# EAGLE schematic atmega32u4-au (EAGLE 8.1.0)
CNAME: ATMEGA32U4-AU; CREVISION: Rev. 0; DESIGNER: German Gonzalez
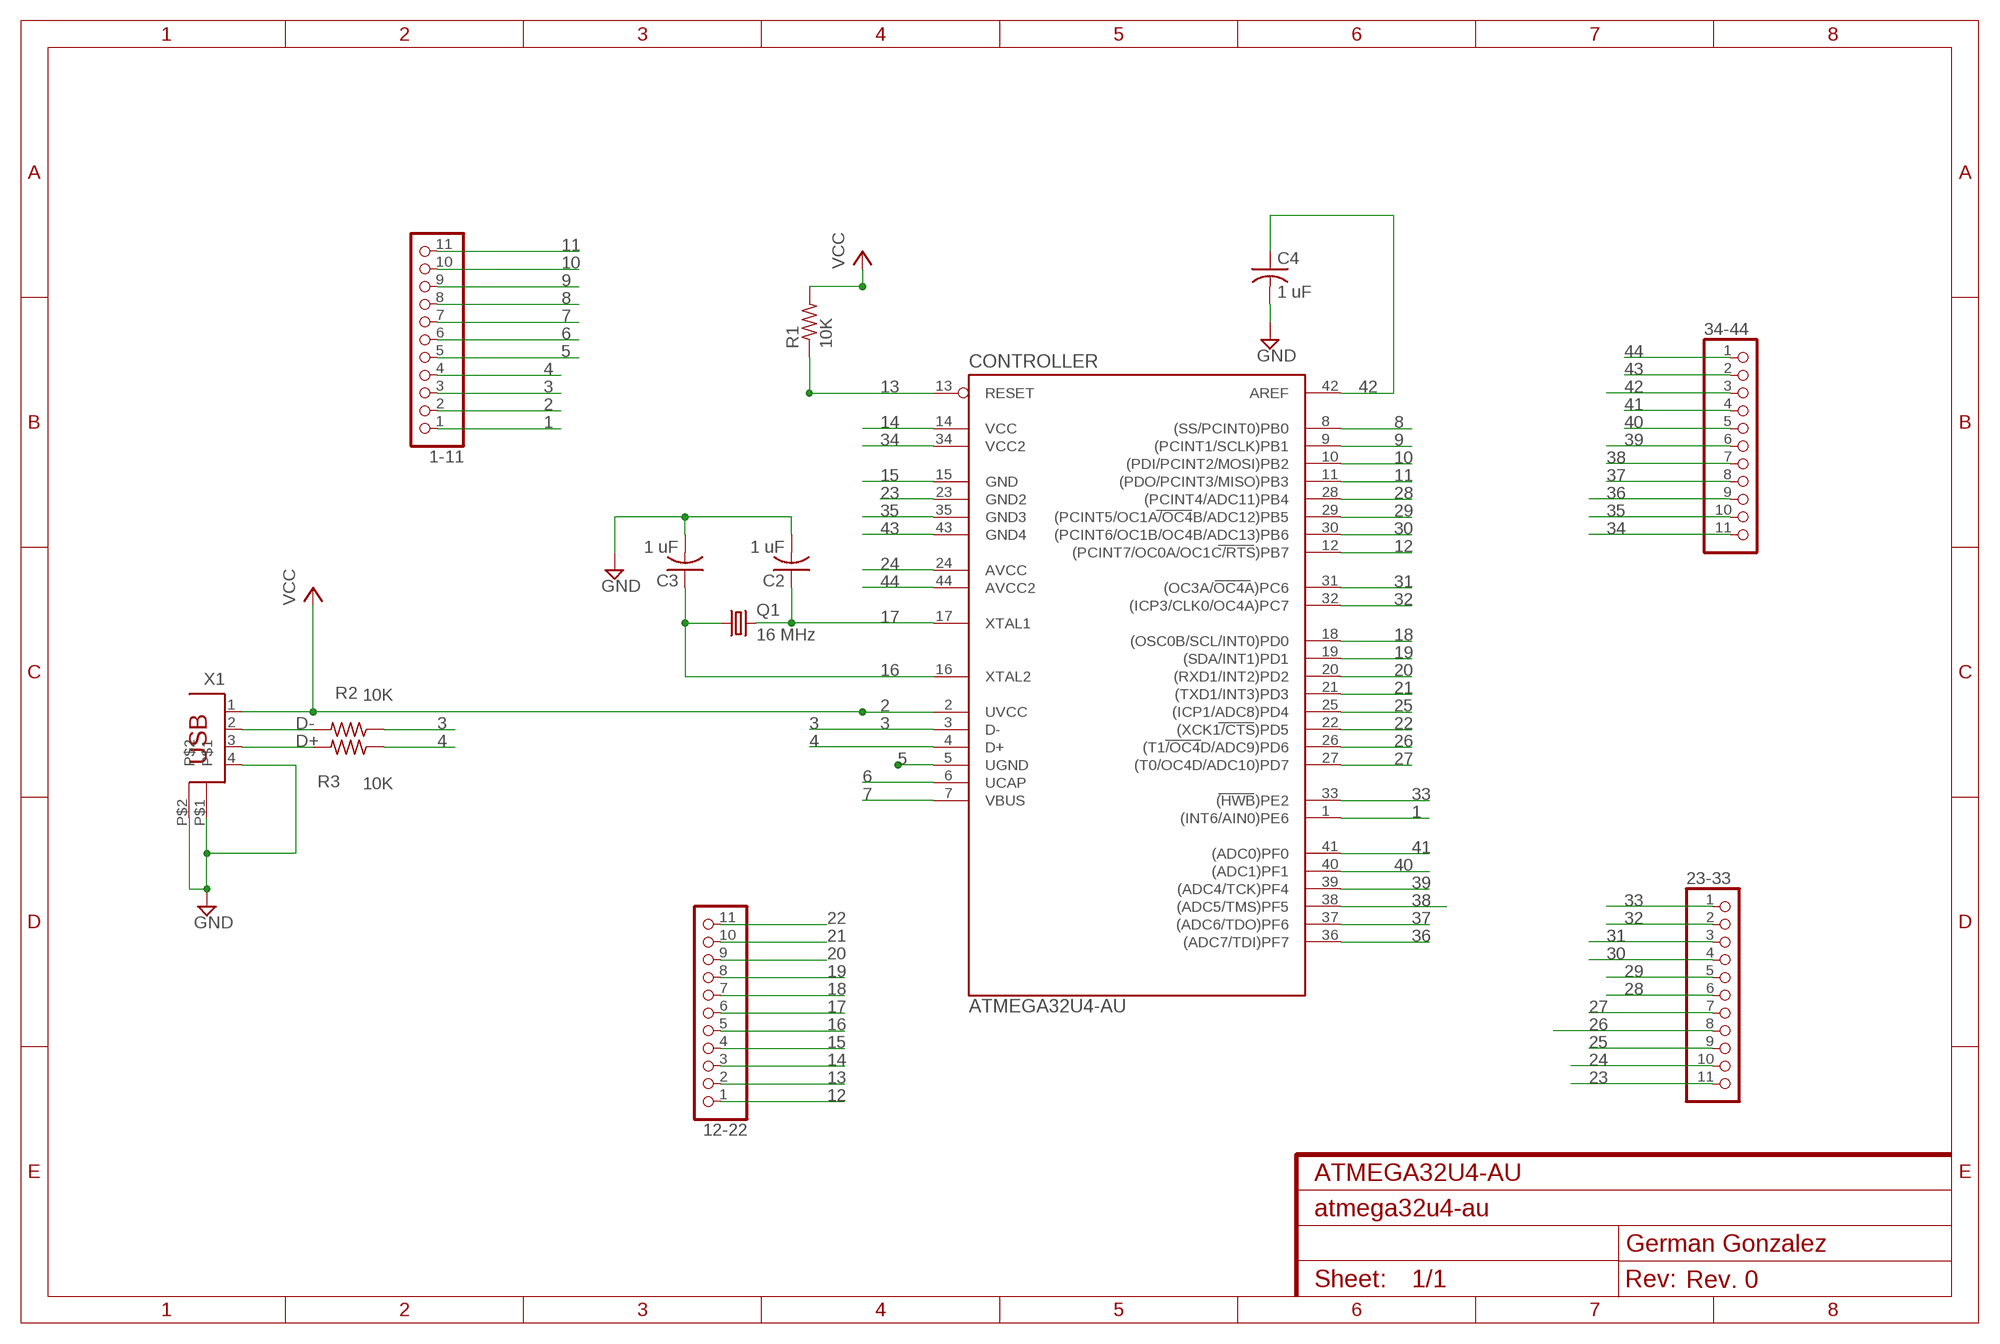
[diagram p0: schematic, sheet 1]

## Parts
1-11  PINHD-1X11  [1X11]
12-22  PINHD-1X11  [1X11]
23-33  PINHD-1X11  [1X11]
34-44  PINHD-1X11  [1X11]
C2  1 uF  C-US025-024X044  [C025-024X044]
C3  1 uF  C-US025-024X044  [C025-024X044]
C4  1 uF  C-US025-024X044  [C025-024X044]
CONTROLLER  ATMEGA32U4-AU  [TQFP44]
Q1  16 MHz  CRYSTALHC18U-V  [HC18U-V]
R1  10K  R-US_M0805  [M0805]
R2  10K  R-US_M0805  [M0805]
R3  10K  R-US_M0805  [M0805]
X1  PN61729  [PN61729]

## Nets
1: 1-11.1 CONTROLLER.1((INT6/AIN0)PE6)
2: 1-11.2 CONTROLLER.2(UVCC) X1.1 ; supply symbol labelled VCC
3: 1-11.3 CONTROLLER.3(D-) R2.1
4: 1-11.4 CONTROLLER.4(D+) R3.1
5: 1-11.5 CONTROLLER.5(UGND)
6: 1-11.6 CONTROLLER.6(UCAP)
7: 1-11.7 CONTROLLER.7(VBUS)
8: 1-11.8 CONTROLLER.8((SS/PCINT0)PB0)
9: 1-11.9 CONTROLLER.9((PCINT1/SCLK)PB1)
10: 1-11.10 CONTROLLER.10((PDI/PCINT2/MOSI)PB2)
11: 1-11.11 CONTROLLER.11((PDO/PCINT3/MISO)PB3)
12: 12-22.1 CONTROLLER.12((PCINT7/OC0A/OC1C/RTS)PB7)
13: 12-22.2 CONTROLLER.13(RESET) R1.1
14: 12-22.3 CONTROLLER.14(VCC)
15: 12-22.4 CONTROLLER.15(GND)
16: 12-22.5 C3.1 CONTROLLER.16(XTAL2) Q1.1
17: 12-22.6 C2.1 CONTROLLER.17(XTAL1) Q1.2
18: 12-22.7 CONTROLLER.18((OSC0B/SCL/INT0)PD0)
19: 12-22.8 CONTROLLER.19((SDA/INT1)PD1)
20: 12-22.9 CONTROLLER.20((RXD1/INT2)PD2)
21: 12-22.10 CONTROLLER.21((TXD1/INT3)PD3)
22: 12-22.11 CONTROLLER.22((XCK1/CTS)PD5)
23: 23-33.11 CONTROLLER.23(GND2)
24: 23-33.10 CONTROLLER.24(AVCC)
25: 23-33.9 CONTROLLER.25((ICP1/ADC8)PD4)
26: 23-33.8 CONTROLLER.26((T1/OC4D/ADC9)PD6)
27: 23-33.7 CONTROLLER.27((T0/OC4D/ADC10)PD7)
28: 23-33.6 CONTROLLER.28((PCINT4/ADC11)PB4)
29: 23-33.5 CONTROLLER.29((PCINT5/OC1A/OC4B/ADC12)PB5)
30: 23-33.4 CONTROLLER.30((PCINT6/OC1B/OC4B/ADC13)PB6)
31: 23-33.3 CONTROLLER.31((OC3A/OC4A)PC6)
32: 23-33.2 CONTROLLER.32((ICP3/CLK0/OC4A)PC7)
33: 23-33.1 CONTROLLER.33((HWB)PE2)
34: 34-44.11 CONTROLLER.34(VCC2)
35: 34-44.10 CONTROLLER.35(GND3)
36: 34-44.9 CONTROLLER.36((ADC7/TDI)PF7)
37: 34-44.8 CONTROLLER.37((ADC6/TDO)PF6)
38: 34-44.7 CONTROLLER.38((ADC5/TMS)PF5)
39: 34-44.6 CONTROLLER.39((ADC4/TCK)PF4)
40: 34-44.5 CONTROLLER.40((ADC1)PF1)
41: 34-44.4 CONTROLLER.41((ADC0)PF0)
42: 34-44.3 C4.1 CONTROLLER.42(AREF)
43: 34-44.2 CONTROLLER.43(GND4)
44: 34-44.1 CONTROLLER.44(AVCC2)
D+: R3.2 X1.3
D-: R2.2 X1.2
GND: C2.2 C3.2 C4.2 X1.4 X1.P$1 X1.P$2
VCC: R1.2

## Library data of the parts
1-11 12-22 23-33 34-44 = pinhead:PINHD-1X11: PIN HEADER
C2-C4 = resistor:C-US: CAPACITOR, American symbol
CONTROLLER = mega32U4:ATMEGA32U4-AU
Q1 = crystal:CRYSTAL: CRYSTAL; OC_FARNELL: unknown; OC_NEWARK: unknown
R1-R3 = resistor:R-US_: RESISTOR, American symbol
X1 = SmartPrj:PN61729: BERG USB connector

## Net classes
0 default: width 0.254 mm
1 supply: width 0.66 mm